# EAGLE design 190812-1a (EAGLE 9.4.2)
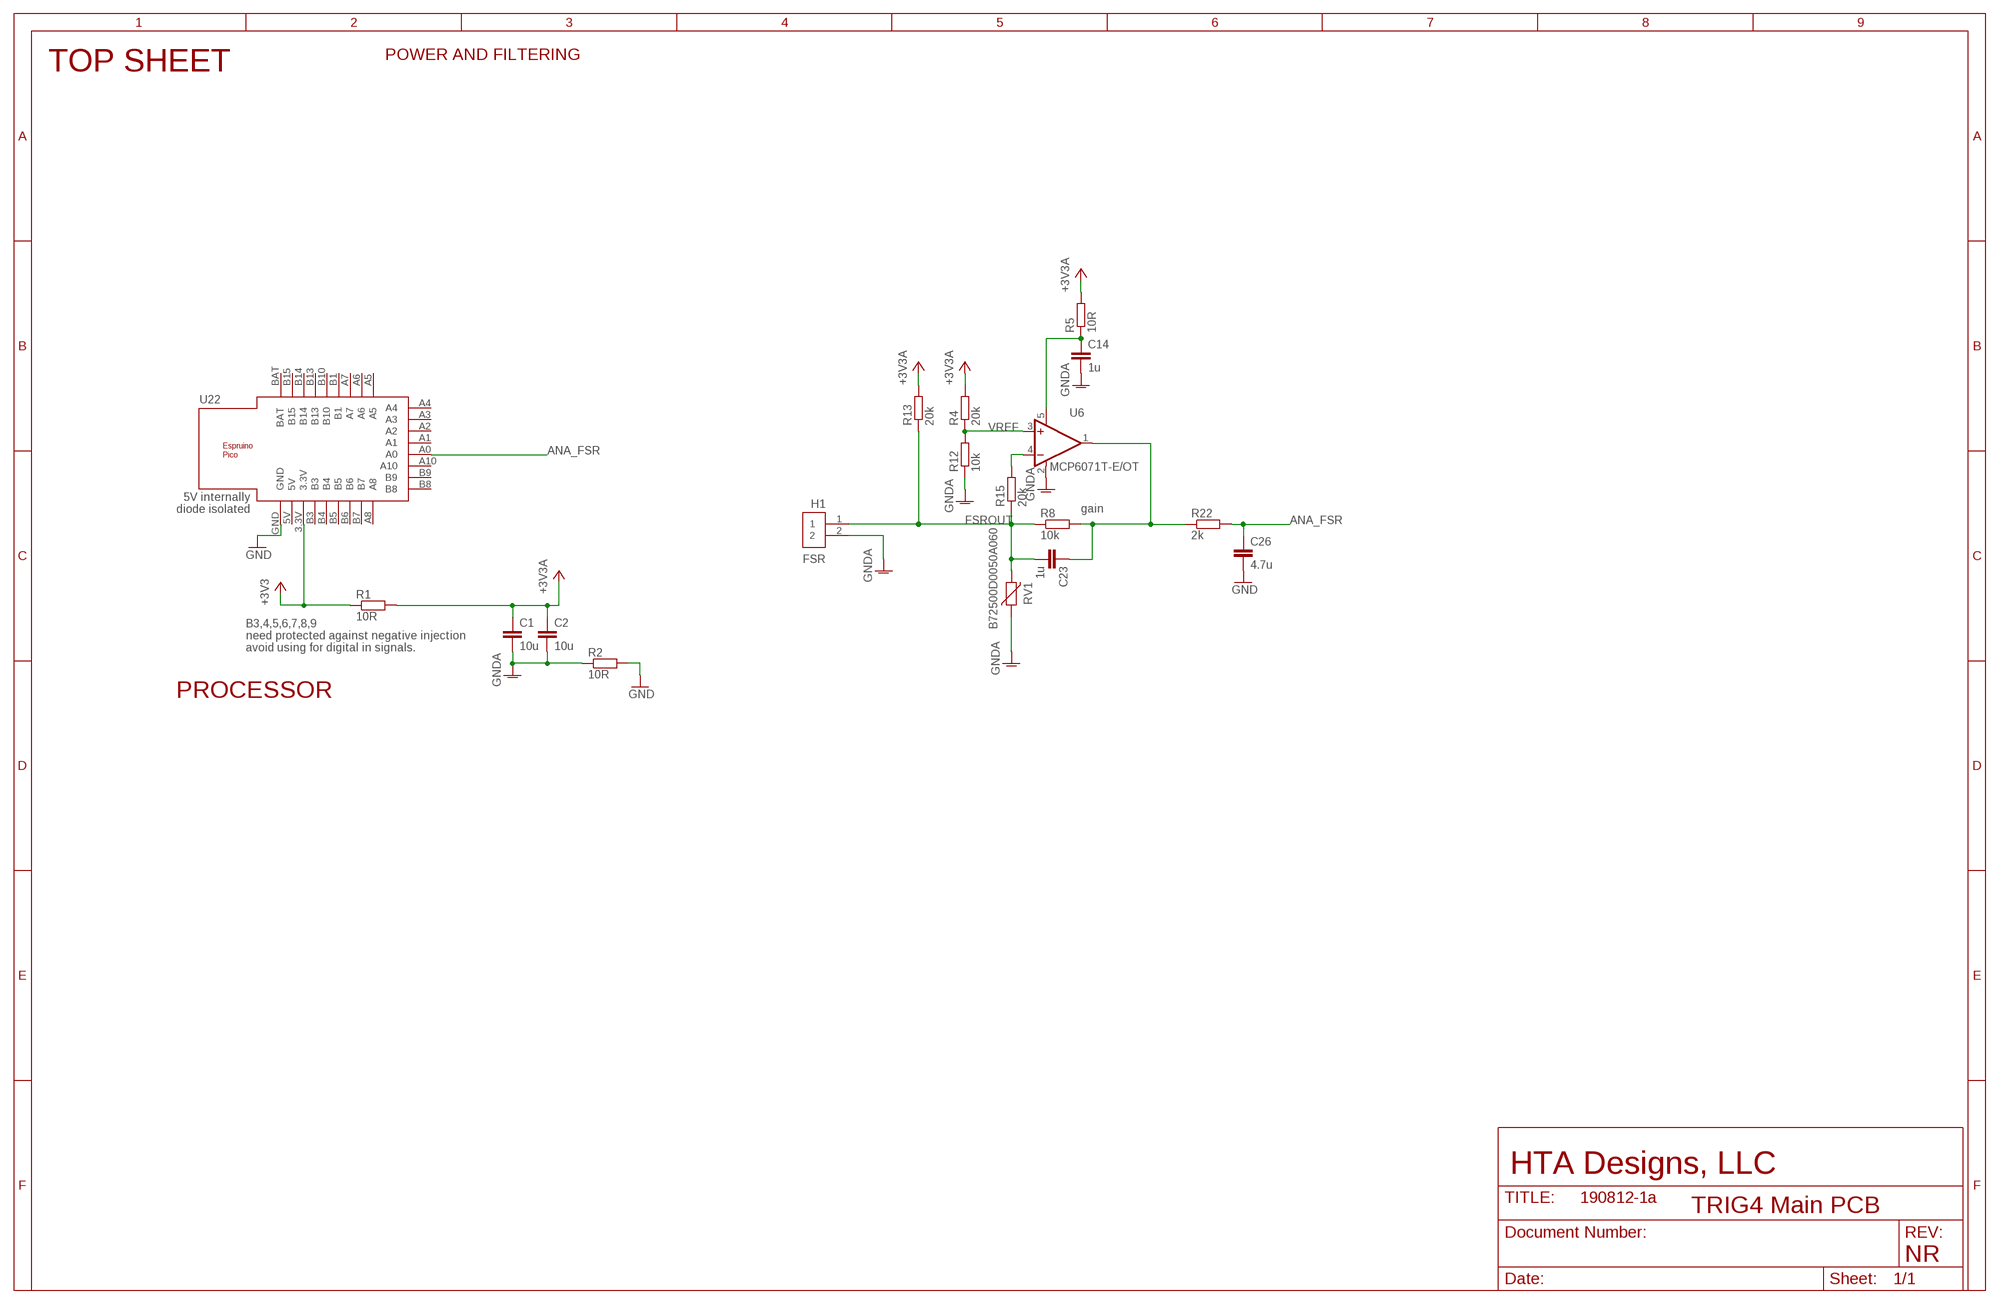
[diagram p0: schematic, sheet 1]

## Parts
C1  10u  C-EUC1206  [C1206]
C2  10u  C-EUC1206  [C1206]
C14  1u  C-EUC0603  [C0603]
C23  1u  C-EUC0805  [C0805]
C26  4.7u  C-EUC0805  [C0805]
H1  FSR-CONNECTOR-RUGER  [1X02]
R1  10R  R-EU_R0603  [R0603]
R2  10R  R-EU_R0603  [R0603]
R4  20k  R-EU_R0603  [R0603]
R5  10R  R-EU_R0603  [R0603]
R8  10k  R-EU_R0603  [R0603]
R12  10k  R-EU_R0603  [R0603]
R13  20k  R-EU_R0603  [R0603]
R15  20k  R-EU_R0603  [R0603]
R22  2k  R-EU_R0603  [R0603]
RV1  B72500D0050A060  [VARC1608X90]
U6  MCP6071T-E/OT  [SOT95P270X145-5]
U22  ESPRUINO_PICO_SMDONLY  [ESPRUINO_PICO_SMDONLY]

## Nets
+3V3: R1.1 U22.3.3V
+3V3A: C1.1 C2.1 R1.2 R4.2 R5.2 R13.2
ANA_FSR: C26.1 R22.2 U22.A0
FSR_OUT1: C23.1 R8.2 R22.1 U6.1(OUT)
FSROUT: C23.2 H1.1 R8.1 R13.1 R15.1 RV1.2
GND: C26.2 R2.2 U22.GND
GNDA: C1.2 C2.2 C14.2 H1.2 R2.1 R12.1 RV1.1 U6.2(V-)
N$11: R15.2 U6.4(-IN)
N$18: C14.1 R5.1 U6.5(V+)
VREF: R4.1 R12.2 U6.3(+IN)
Unconnected: U22.5V U22.A1 U22.A2 U22.A3 U22.A4 U22.A5 U22.A6 U22.A7 U22.A8 U22.A10 U22.B1 U22.B3 U22.B4 U22.B5 U22.B6 U22.B7 U22.B8 U22.B9 U22.B10 U22.B13 U22.B14 U22.B15 U22.BAT

## Notes on the sheet
- POWER AND FILTERING
- TOP SHEET
- 5V internally
  diode isolated
- gain
- FSR
- B3,4,5,6,7,8,9
  need protected against negative injection
  avoid using for digital in signals.
- PROCESSOR
- HTA Designs, LLC
- TRIG4 Main PCB
- NR

## Library data of the parts
C1 C2 C14 C23 C26 = rcl:C-EU: CAPACITOR, European symbol; SPICEPREFIX: C
H1 = connectors-rmg:FSR-CONNECTOR-RUGER: FSR Connector for the Ruger Trigger project This is simply a 0.1" pin header connection. (2 positions).
R1 R2 R4 R5 R8 R12 R13 R15 R22 = rcl:R-EU_: RESISTOR, European symbol; SPICEPREFIX: R
RV1 = diodes-rmg:B72500D0050A060: VARISTOR 6.4V 30A 0603 Maximum DC Volts 5.6V Varistor Voltage (Min) 6.4V Current - Surge 30A Energy - Number of Circuits 1 Capacitance @ Frequency 470pF @ 1MHz Operating Temperature -40°C ~ 85°C (TA)
U6 = analog-rmg:MCP6071T-E/OT: 110uA precision op amp 1.8V to 6.0V rail to rail input and output 1.2MHz GBP unity gain stable. 150uV offset voltage
U22 = espruino_pico:ESPRUINO_PICO_SMDONLY: Espruino Pico Created from Espruino library and modified by adding a 3D model from Fusion 360.

## Net classes
1 diff_pair: width 0.25 mm, drill 0.4 mm, clearance 0.2 mm

## Board
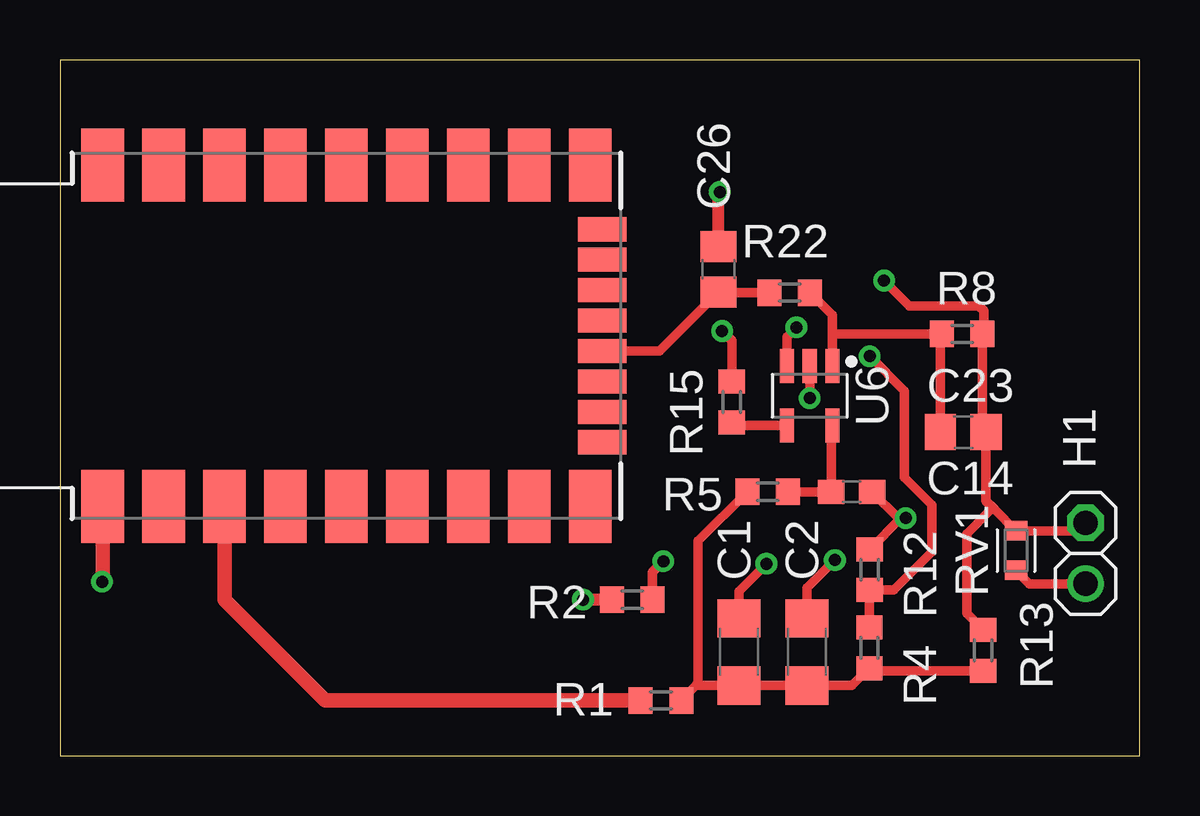
[diagram p1: board, top side]
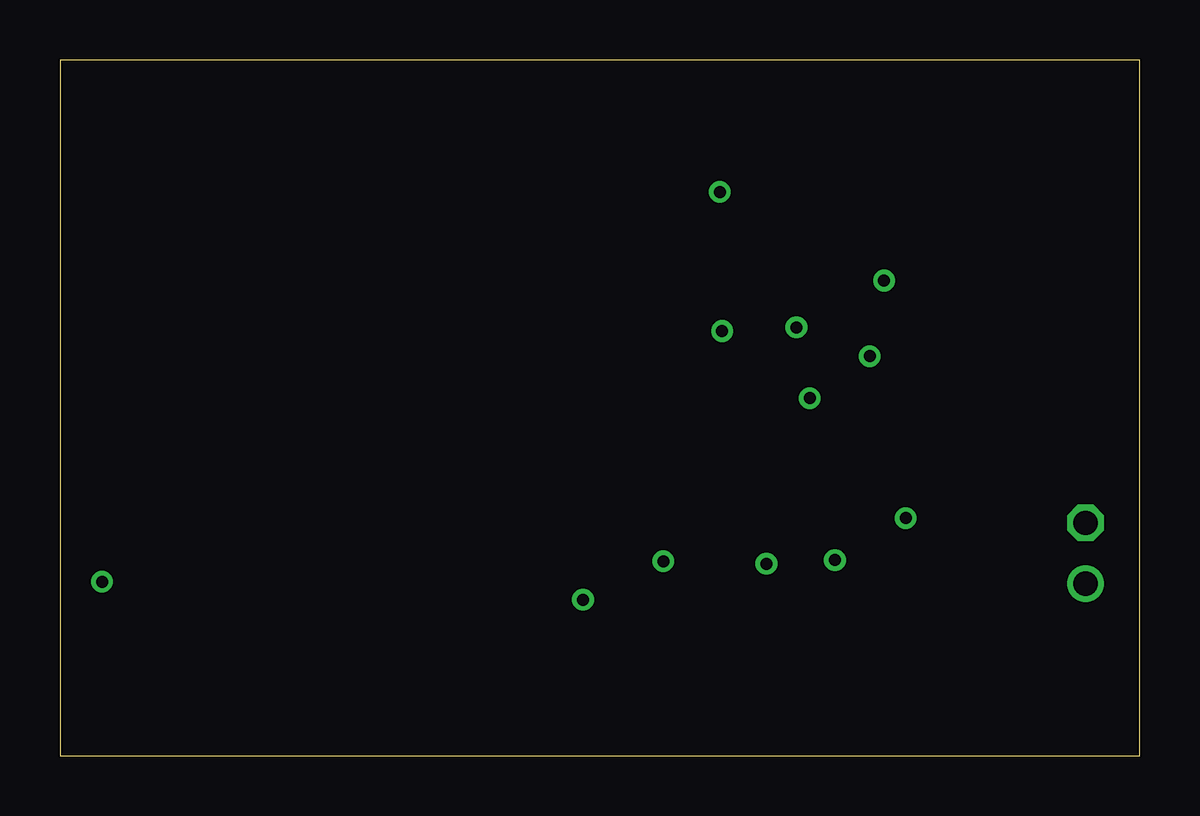
[diagram p2: board, inner layer Route2]
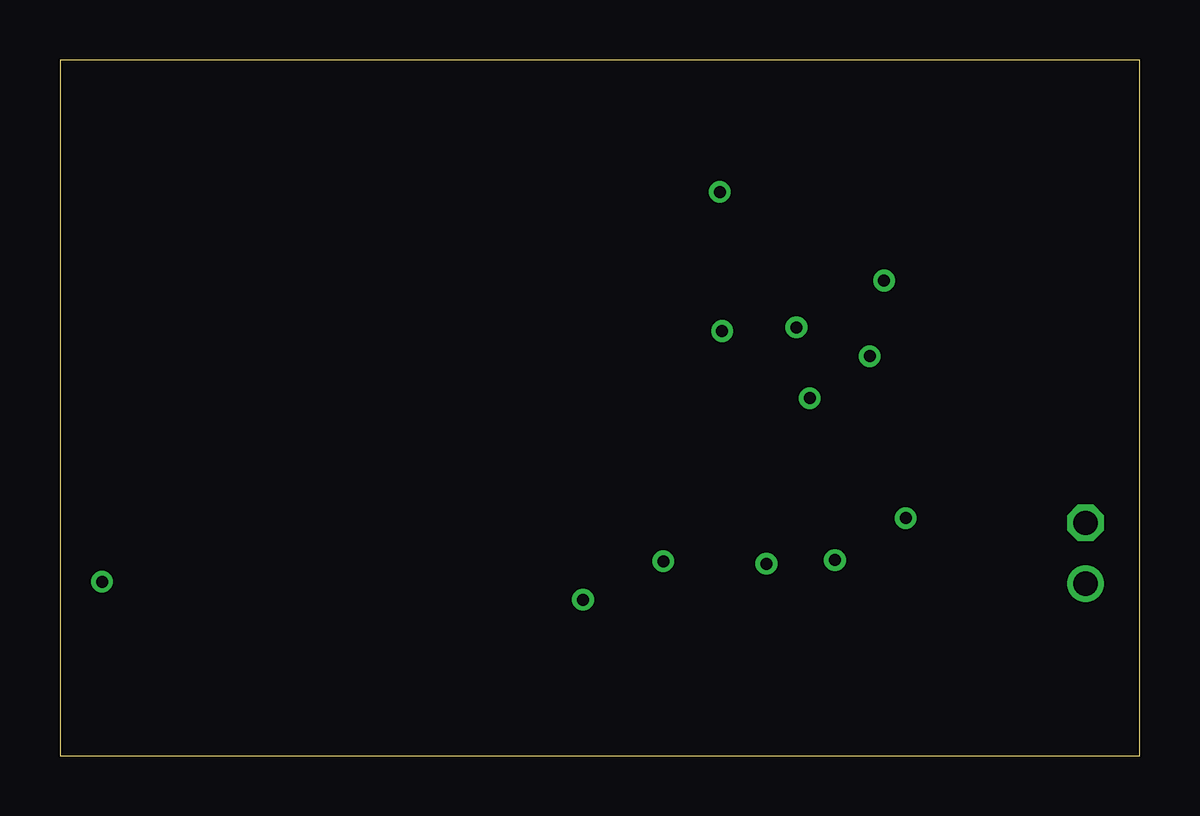
[diagram p3: board, inner layer Route3]
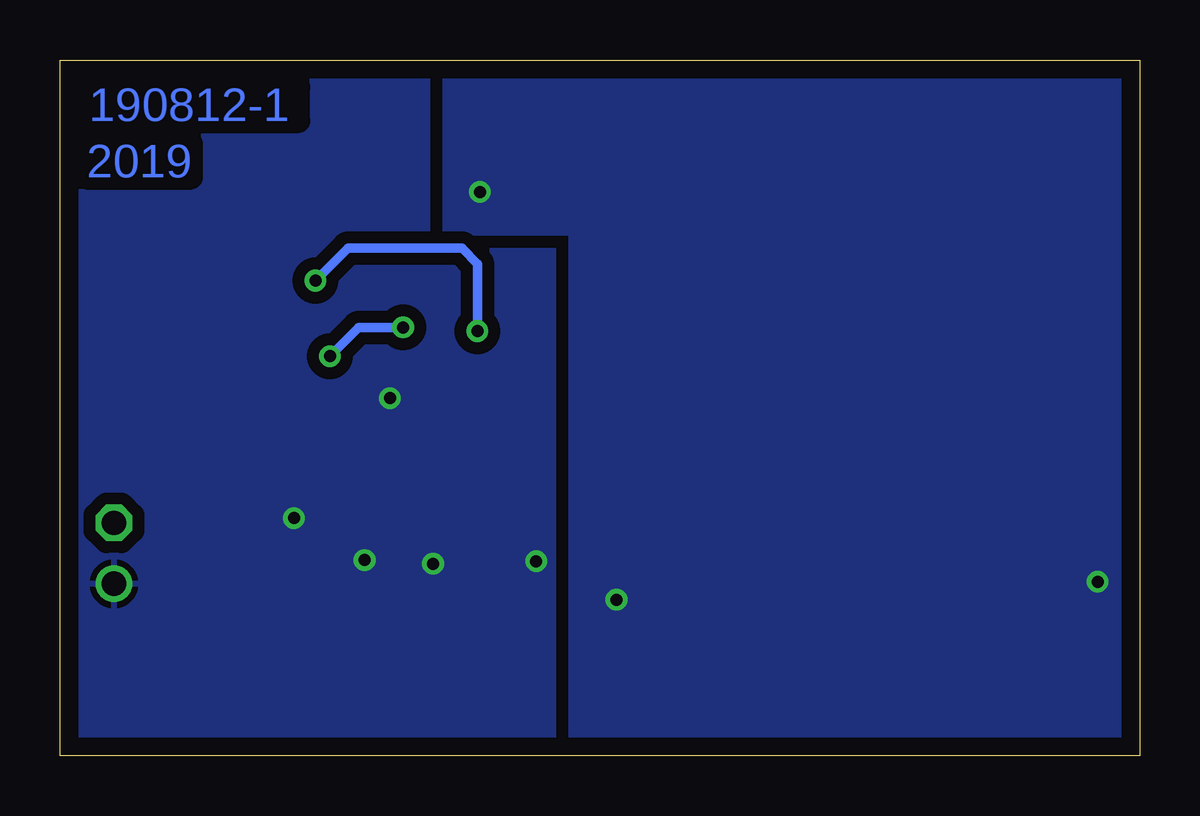
[diagram p4: board, bottom side, seen from below]

Size 45 x 29 mm. Coordinates in mm from the lower left corner, seen from the top.
Outline: 0,0 45,0 45,29 0,29 0,0
Copper layers (1*16): Top 0.035mm / dielectric 1.5mm / Bottom 0.035mm
Design rules "default *": minimum track width 6mil, minimum drill 0.35mm, track to track 6mil, track to pad 6mil, pad to pad 6mil, via to via 6mil, smd to smd 6mil, copper to edge 30mil, drill to drill 6mil, minimum pad ring 10mil, minimum via ring 8mil, stop-mask expansion 4mil, vias tented up to drill 0.5mm, thermal gap 10mil

### Footprints (pad centres in the part's own frame; a part is rotated, then mirrored left to right if it is on the bottom)
C1206 = smd 1.6 x 1.8: 1 -1.4,0; 2 1.4,0
C0603 = smd 1.1 x 1: 1 -0.85,0; 2 0.85,0
C0805 = smd 1.3 x 1.5: 1 -0.95,0; 2 0.95,0
1X02 = drill 1.016 octagon: 1 -2.54,0 | drill 1.016: 2 0,0
R0603 = smd 1 x 1.1: 1 -0.85,0; 2 0.85,0
VARC1608X90 = smd 0.821 x 0.929: 1 -0.825,0; 2 0.825,0
SOT95P270X145-5 = smd 1.412 x 0.59: 1 -1.247,0.95; 2 -1.247,0; 3 -1.247,-0.95; 4 1.247,-0.95; 5 1.247,0.95
ESPRUINO_PICO_SMDONLY = smd 1.778 x 3.048: 3.3V -8.89,-7.112; 5V -11.43,-7.112; A5 6.35,7.112; A6 3.81,7.112; A7 1.27,7.112; A8 6.35,-7.112; B1 -1.27,7.112; B3 -6.35,-7.112; B4 -3.81,-7.112; B5 -1.27,-7.112; B6 1.27,-7.112; B7 3.81,-7.112; B10 -3.81,7.112; B13 -6.35,7.112; B14 -8.89,7.112; B15 -11.43,7.112; BAT -13.97,7.112; GND -13.97,-7.112 | smd 2.032 x 1.016: A0 6.858,-0.635; A1 6.858,0.635; A2 6.858,1.905; A3 6.858,3.175; A4 6.858,4.445; A10 6.858,-1.905; B8 6.858,-4.445; B9 6.858,-3.175

### Placement (x,y rotation side)
C1  28.3,4.32 90 top
C2  31.13,4.32 90 top
C14  33,11 0 top
C23  37.65,13.48 0 top
C26  27.45,20.27 90 top
H1  42.75,7.16 270 top
R1  25.05,2.3 0 top
R2  23.85,6.5 180 top
R4  33.74,4.49 270 top
R5  29.5,11 180 top
R8  37.6,17.58 180 top
R12  33.75,7.75 270 top
R13  38.48,4.39 270 top
R15  28,14.74 270 top
R22  30.42,19.3 180 top
RV1  39.85,8.55 90 top
U6  31.25,15 270 top
U22  15.75,17.5 0 top

### Tracks (layer width: path | path; a pad name or v marks a point on that pad's centre or on a via)
+3V3
  Top 0.6: U22.3.3V 6.86,6.49 11.05,2.3 R1.1
  pour Route3 (isolate 0.4): -31.01,-8.82 -6.61,-8.82 -6.61,-41.52 -31.01,-41.52
  pour Route3 (isolate 0.4): -147.85,-378.39 -123.45,-378.39 -123.45,-411.09 -147.85,-411.09
+3V3A
  Top 0.4: R13.2 33.84,3.54 R4.2 33.02,2.92 C2.1 C1.1 26.52,2.92 | R1.2 26.52,2.92 | 26.52,2.92 26.6,3 26.6,8.95 R5.2
ANA_FSR
  Top 0.4: U22.A0 25,16.86 C26.1 27.47,19.3 R22.2
FSR_OUT1
  Top 0.4: U6.1 32.2,17.6 | 32.2,17.6 32.2,18.37 R22.1 | 32.2,17.6 32.22,17.58 R8.2 36.7,17.53 C23.1
FSROUT  (via drill 0.5)
  Top 0.4: 38.96,10.26 38.6,10.62 C23.2 38.45,13.63 R8.1 38.5,17.63 38.5,18.55 38.3,18.75 35.4,18.75 v34.35,19.8 | 38.96,10.26 RV1.2 42.42,9.38 H1.1 | R13.1 37.8,5.92 37.8,9.25 38.81,10.26 38.96,10.26 | R15.1 28,17.3 v27.6,17.7
  Bottom 0.4: v34.35,19.8 33,21.15 28.25,21.15 27.6,20.5 v27.6,17.7
GND  (via drill 0.5)
  Top 0.5: R2.2 v21.8,6.5 | C26.2 27.45,23.45 v27.5,23.5
  Top 0.6: U22.GND 1.78,7.28 v1.75,7.25
  pour Route2 (isolate 0.4): -33.01,-8.42 2.69,-8.42 2.69,-44.82 -33.01,-44.82
  pour Route2 (isolate 0.4): -149.85,-377.99 -114.15,-377.99 -114.15,-414.39 -149.85,-414.39
  pour Bottom (isolate 0.5): 0,0 0,29 29,29 29,21.75 23.75,21.75 23.75,0
GNDA  (via drill 0.5)
  Top 0.4: R2.1 24.7,7.65 v25.15,8.1 | C1.2 28.3,6.85 v29.45,8 | H1.2 40.41,7.16 RV1.1 | R12.1 35.05,9.9 v35.25,9.9 34.95,9.9 C14.2 | U6.2 v31.25,14.9 | C2.2 31.13,6.98 v32.3,8.15
  pour Bottom (isolate 0.5, rank 2): 45,29 29,29 29,21.25 23.75,21.25 23.75,0 45,0
N$11
  Top 0.4: U6.4 28.14,13.75 R15.2
N$18
  Top 0.4: R5.1 C14.1 32.15,13.7 U6.5
VREF  (via drill 0.5)
  Top 0.4: R4.1 R12.2 34.75,6.9 36.35,8.5 36.35,10.45 35.2,11.6 35.2,15.2 v33.75,16.65 | U6.3 30.3,17.45 v30.7,17.85
  Bottom 0.4: v30.7,17.85 32.55,17.85 v33.75,16.65

### Text on the board
Bottom: 190812-1 | 2019